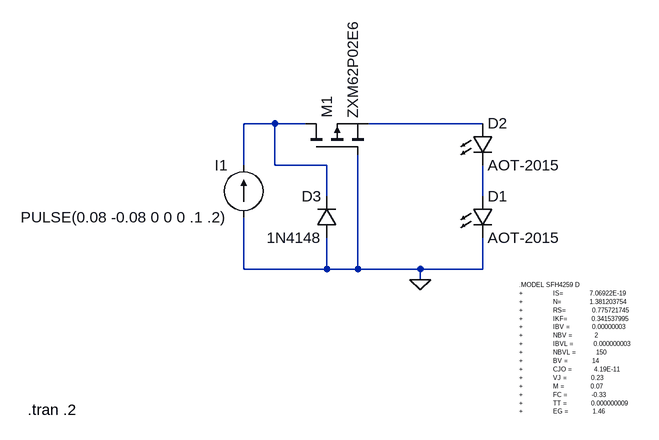
[diagram p0: schematic SpiceModel.asc]
SpiceModel.asc, the LTspice schematic file:
Version 4
SHEET 1 1528 1144
WIRE 640 368 592 368
WIRE 688 368 640 368
WIRE 960 368 784 368
WIRE 592 432 592 368
WIRE 640 432 640 368
WIRE 720 432 640 432
WIRE 720 480 720 432
WIRE 960 480 960 432
WIRE 592 592 592 512
WIRE 720 592 720 544
WIRE 720 592 592 592
WIRE 768 592 768 416
WIRE 768 592 720 592
WIRE 864 592 768 592
WIRE 960 592 960 544
WIRE 960 592 864 592
WIRE 864 608 864 592
FLAG 864 608 0
SYMBOL LED 944 368 R0
SYMATTR InstName D2
SYMATTR Value AOT-2015
SYMBOL LED 944 480 R0
SYMATTR InstName D1
SYMATTR Value AOT-2015
SYMATTR Description Diode
SYMATTR Type diode
SYMBOL pmos 688 416 R270
SYMATTR InstName M1
SYMATTR Value ZXM62P02E6
SYMBOL current 592 512 R180
WINDOW 0 24 80 Left 2
WINDOW 3 24 0 Left 2
WINDOW 123 0 0 Left 0
WINDOW 39 0 0 Left 0
SYMATTR InstName I1
SYMATTR Value PULSE(0.08 -0.08 0 0 0 .1 .2)
SYMBOL diode 736 544 R180
WINDOW 0 24 64 Left 2
WINDOW 3 24 0 Left 2
SYMATTR InstName D3
SYMATTR Value 1N4148
TEXT 1016 616 Left 0 !.MODEL SFH4259 D                                \n+               IS=             7.06922E-19\n+               N=              1.381203754\n+               RS=             0.775721745\n+               IKF=            0.341537995\n+               IBV =           0.00000003\n+               NBV =           2\n+               IBVL =          0.000000003\n+               NBVL =          150\n+               BV =            14\n+               CJO =           4.19E-11\n+               VJ =            0.23\n+               M =             0.07\n+               FC =            -0.33\n+               TT =            0.000000009\n+               EG =            1.46
TEXT 260 808 Left 2 !.tran .2

The netlist it stands for:
* SpiceModel.asc
D2 N002 N003 AOT-2015
D1 N003 0 AOT-2015
M1 N001 0 N002 N002 ZXM62P02E6
I1 0 N001 PULSE(0.08 -0.08 0 0 0 .1 .2)
D3 0 N001 1N4148
.model D D
.lib standard.dio
.model NMOS NMOS
.model PMOS PMOS
.lib standard.mos
.MODEL SFH4259 D
+               IS=             7.06922E-19
+               N=              1.381203754
+               RS=             0.775721745
+               IKF=            0.341537995
+               IBV =           0.00000003
+               NBV =           2
+               IBVL =          0.000000003
+               NBVL =          150
+               BV =            14
+               CJO =           4.19E-11
+               VJ =            0.23
+               M =             0.07
+               FC =            -0.33
+               TT =            0.000000009
+               EG =            1.46
.tran .2
.backanno
.end